# EAGLE schematic Bats n Gons (EAGLE 9.5.2)

## Sheet 1 of 2
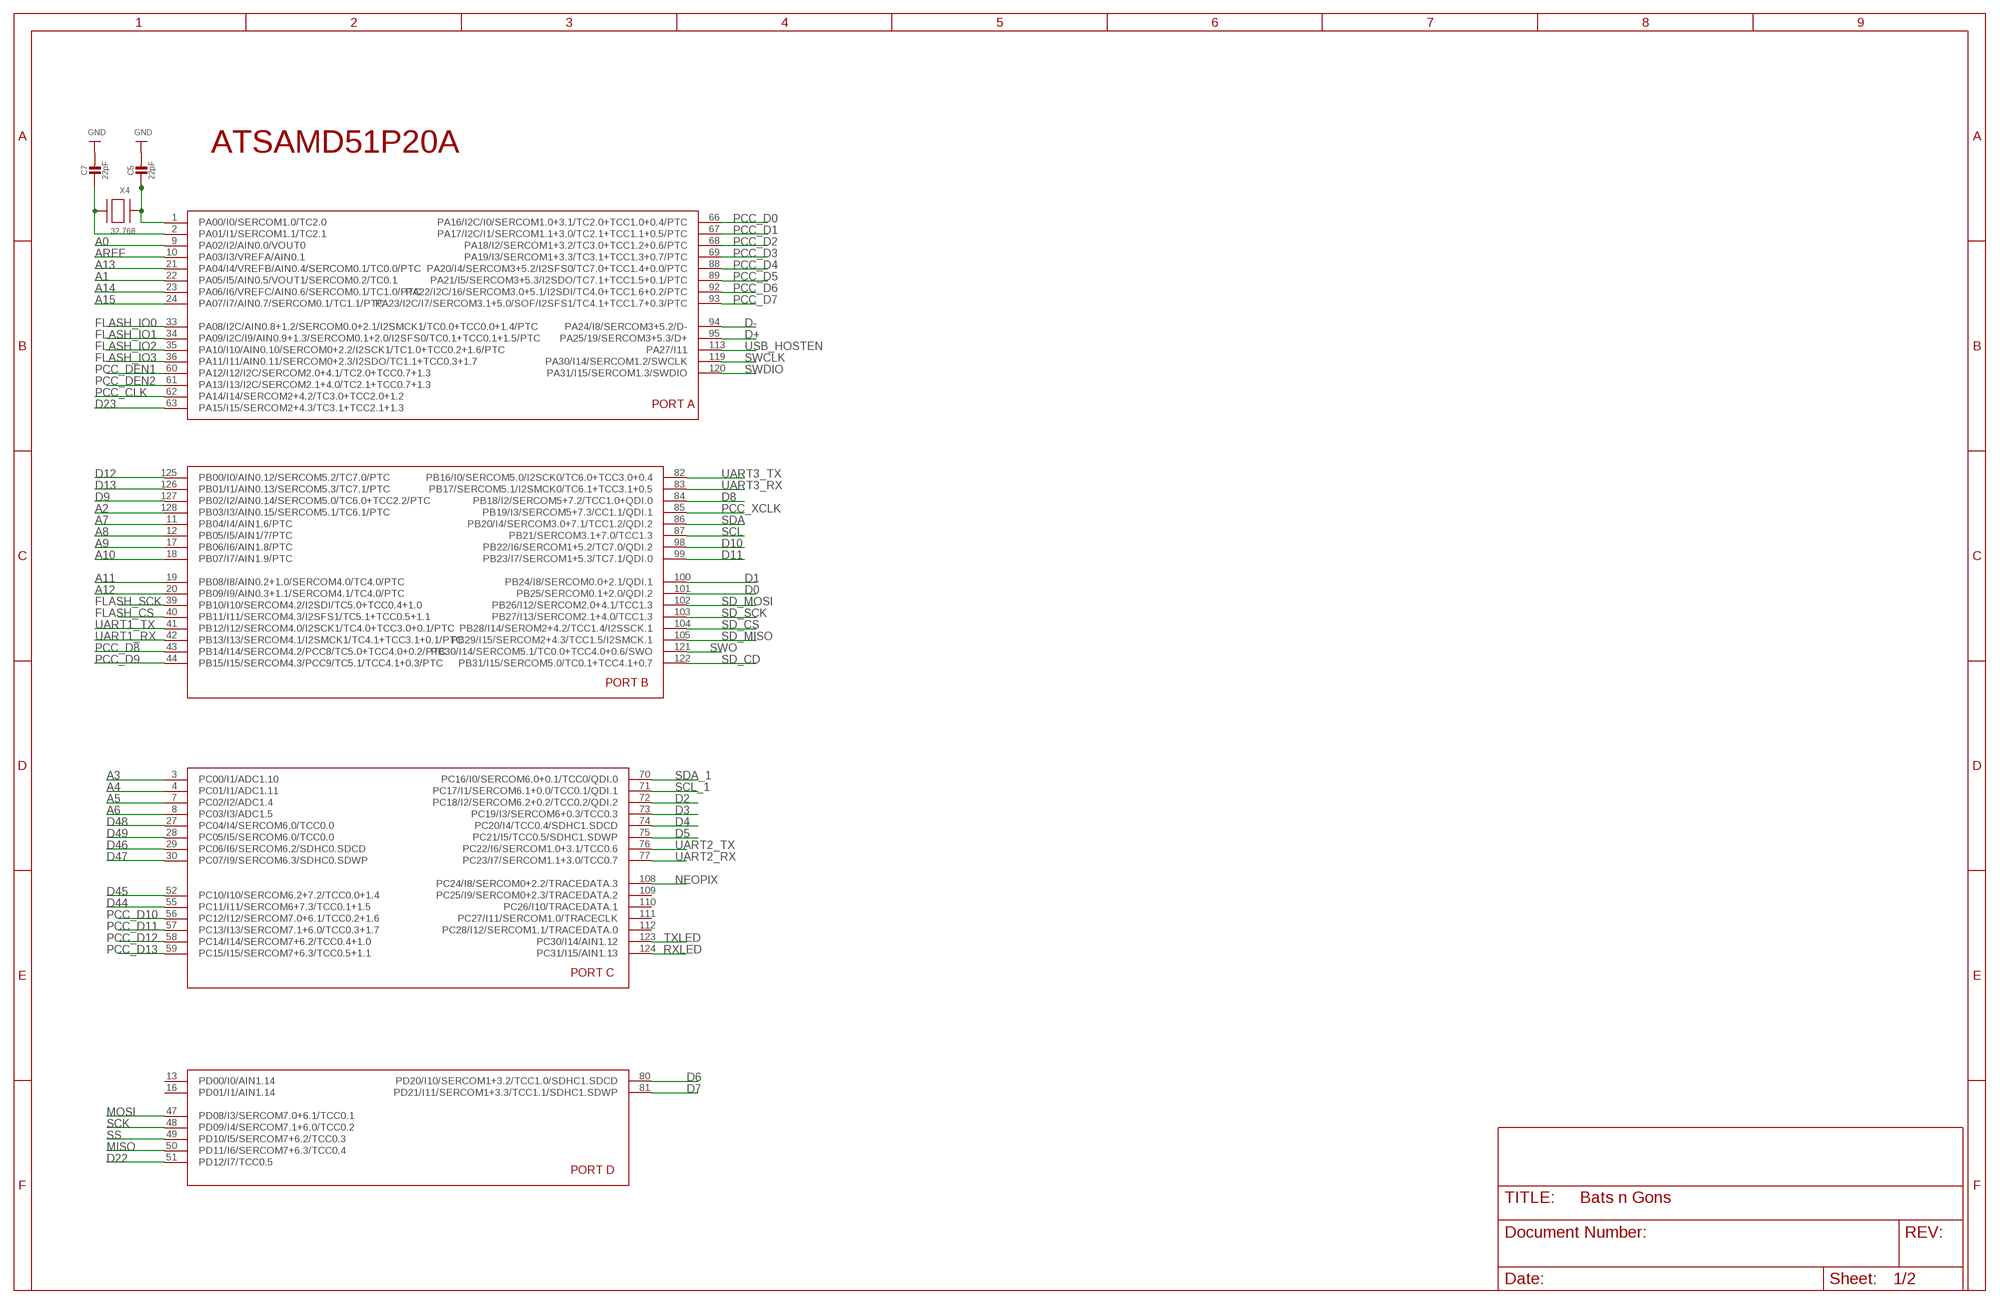
[diagram p0: schematic, sheet 1]

### Parts
C5  22pF  CAP_CERAMIC0603_NO  [0603-NO]
C7  22pF  CAP_CERAMIC0603_NO  [0603-NO]
U$1  SAMD51PXXA  [SQFP-S-14X14-128]
X4  32.768  XTAL-3.2X1.5  [XTAL3215]

### Nets
A0: U$1.9(PA02/I2/AIN0.0/VOUT0)
A1: U$1.22(PA05/I5/AIN0.5/VOUT1/SERCOM0.2/TC0.1)
A2: U$1.128(PB03/I3/AIN0.15/SERCOM5.1/TC6.1/PTC)
A3: U$1.3(PC00/I1/ADC1.10)
A4: U$1.4(PC01/I1/ADC1.11)
A5: U$1.7(PC02/I2/ADC1.4)
A6: U$1.8(PC03/I3/ADC1.5)
A7: U$1.11(PB04/I4/AIN1.6/PTC)
A8: U$1.12(PB05/I5/AIN1/7/PTC)
A9: U$1.17(PB06/I6/AIN1.8/PTC)
A10: U$1.18(PB07/I7/AIN1.9/PTC)
A11: U$1.19(PB08/I8/AIN0.2+1.0/SERCOM4.0/TC4.0/PTC)
A12: U$1.20(PB09/I9/AIN0.3+1.1/SERCOM4.1/TC4.0/PTC)
A13: U$1.21(PA04/I4/VREFB/AIN0.4/SERCOM0.1/TC0.0/PTC)
A14: U$1.23(PA06/I6/VREFC/AIN0.6/SERCOM0.1/TC1.0/PTC)
A15: U$1.24(PA07/I7/AIN0.7/SERCOM0.1/TC1.1/PTC)
AREF [aref]: U$1.10(PA03/I3/VREFA/AIN0.1)
D0: U$1.101(PB25/SERCOM0.1+2.0/QDI.2)
D1: U$1.100(PB24/I8/SERCOM0.0+2.1/QDI.1)
D2: U$1.72(PC18/I2/SERCOM6.2+0.2/TCC0.2/QDI.2)
D3: U$1.73(PC19/I3/SERCOM6+0.3/TCC0.3)
D4: U$1.74(PC20/I4/TCC0.4/SDHC1.SDCD)
D5: U$1.75(PC21/I5/TCC0.5/SDHC1.SDWP)
D6: U$1.80(PD20/I10/SERCOM1+3.2/TCC1.0/SDHC1.SDCD)
D7: U$1.81(PD21/I11/SERCOM1+3.3/TCC1.1/SDHC1.SDWP)
D8: U$1.84(PB18/I2/SERCOM5+7.2/TCC1.0+QDI.0)
D9: U$1.127(PB02/I2/AIN0.14/SERCOM5.0/TC6.0+TCC2.2/PTC)
D10: U$1.98(PB22/I6/SERCOM1+5.2/TC7.0/QDI.2)
D11: U$1.99(PB23/I7/SERCOM1+5.3/TC7.1/QDI.0)
D12: U$1.125(PB00/I0/AIN0.12/SERCOM5.2/TC7.0/PTC)
D13: U$1.126(PB01/I1/AIN0.13/SERCOM5.3/TC7.1/PTC)
D22: U$1.51(PD12/I7/TCC0.5)
D23: U$1.63(PA15/I15/SERCOM2+4.3/TC3.1+TCC2.1+1.3)
D44: U$1.55(PC11/I11/SERCOM6+7.3/TCC0.1+1.5)
D45: U$1.52(PC10/I10/SERCOM6.2+7.2/TCC0.0+1.4)
D46: U$1.29(PC06/I6/SERCOM6.2/SDHC0.SDCD)
D47: U$1.30(PC07/I9/SERCOM6.3/SDHC0.SDWP)
D48: U$1.27(PC04/I4/SERCOM6.0/TCC0.0)
D49: U$1.28(PC05/I5/SERCOM6.0/TCC0.0)
D+ [USB]: U$1.95(PA25/19/SERCOM3+5.3/D+)
D- [USB]: U$1.94(PA24/I8/SERCOM3+5.2/D-)
FLASH_CS: U$1.40(PB11/I11/SERCOM4.3/I2SFS1/TC5.1+TCC0.5+1.1)
FLASH_IO0: U$1.33(PA08/I2C/AIN0.8+1.2/SERCOM0.0+2.1/I2SMCK1/TC0.0+TCC0.0+1.4/PTC)
FLASH_IO1: U$1.34(PA09/I2C/I9/AIN0.9+1.3/SERCOM0.1+2.0/I2SFS0/TC0.1+TCC0.1+1.5/PTC)
FLASH_IO2: U$1.35(PA10/I10/AIN0.10/SERCOM0+2.2/I2SCK1/TC1.0+TCC0.2+1.6/PTC)
FLASH_IO3: U$1.36(PA11/I11/AIN0.11/SERCOM0+2.3/I2SDO/TC1.1+TCC0.3+1.7)
FLASH_SCK: U$1.39(PB10/I10/SERCOM4.2/I2SDI/TC5.0+TCC0.4+1.0)
GND [gnd]: C5.2 C7.2
MISO: U$1.50(PD11/I6/SERCOM7+6.3/TCC0.4)
MOSI: U$1.47(PD08/I3/SERCOM7.0+6.1/TCC0.1)
N$9: C5.1 U$1.1(PA00/I0/SERCOM1.0/TC2.0) X4.P$1
N$12: C7.1 U$1.2(PA01/I1/SERCOM1.1/TC2.1) X4.P$2
NEOPIX: U$1.108(PC24/I8/SERCOM0+2.2/TRACEDATA.3)
PCC_CLK: U$1.62(PA14/I14/SERCOM2+4.2/TC3.0+TCC2.0+1.2)
PCC_D0: U$1.66(PA16/I2C/I0/SERCOM1.0+3.1/TC2.0+TCC1.0+0.4/PTC)
PCC_D1: U$1.67(PA17/I2C/I1/SERCOM1.1+3.0/TC2.1+TCC1.1+0.5/PTC)
PCC_D2: U$1.68(PA18/I2/SERCOM1+3.2/TC3.0+TCC1.2+0.6/PTC)
PCC_D3: U$1.69(PA19/I3/SERCOM1+3.3/TC3.1+TCC1.3+0.7/PTC)
PCC_D4: U$1.88(PA20/I4/SERCOM3+5.2/I2SFS0/TC7.0+TCC1.4+0.0/PTC)
PCC_D5: U$1.89(PA21/I5/SERCOM3+5.3/I2SDO/TC7.1+TCC1.5+0.1/PTC)
PCC_D6: U$1.92(PA22/I2C/16/SERCOM3.0+5.1/I2SDI/TC4.0+TCC1.6+0.2/PTC)
PCC_D7: U$1.93(PA23/I2C/I7/SERCOM3.1+5.0/SOF/I2SFS1/TC4.1+TCC1.7+0.3/PTC)
PCC_D8: U$1.43(PB14/I14/SERCOM4.2/PCC8/TC5.0+TCC4.0+0.2/PTC)
PCC_D9: U$1.44(PB15/I15/SERCOM4.3/PCC9/TC5.1/TCC4.1+0.3/PTC)
PCC_D10: U$1.56(PC12/I12/SERCOM7.0+6.1/TCC0.2+1.6)
PCC_D11: U$1.57(PC13/I13/SERCOM7.1+6.0/TCC0.3+1.7)
PCC_D12: U$1.58(PC14/I14/SERCOM7+6.2/TCC0.4+1.0)
PCC_D13: U$1.59(PC15/I15/SERCOM7+6.3/TCC0.5+1.1)
PCC_DEN1: U$1.60(PA12/I12/I2C/SERCOM2.0+4.1/TC2.0+TCC0.7+1.3)
PCC_DEN2: U$1.61(PA13/I13/I2C/SERCOM2.1+4.0/TC2.1+TCC0.7+1.3)
PCC_XCLK: U$1.85(PB19/I3/SERCOM5+7.3/CC1.1/QDI.1)
RXLED: U$1.124(PC31/I15/AIN1.13)
SCK: U$1.48(PD09/I4/SERCOM7.1+6.0/TCC0.2)
SCL: U$1.87(PB21/SERCOM3.1+7.0/TCC1.3)
SCL_1: U$1.71(PC17/I1/SERCOM6.1+0.0/TCC0.1/QDI.1)
SD_CD: U$1.122(PB31/I15/SERCOM5.0/TC0.1+TCC4.1+0.7)
SD_CS: U$1.104(PB28/I14/SEROM2+4.2/TCC1.4/I2SSCK.1)
SD_MISO: U$1.105(PB29/I15/SERCOM2+4.3/TCC1.5/I2SMCK.1)
SD_MOSI: U$1.102(PB26/I12/SERCOM2.0+4.1/TCC1.3)
SD_SCK: U$1.103(PB27/I13/SERCOM2.1+4.0/TCC1.3)
SDA: U$1.86(PB20/I4/SERCOM3.0+7.1/TCC1.2/QDI.2)
SDA_1: U$1.70(PC16/I0/SERCOM6.0+0.1/TCC0/QDI.0)
SS: U$1.49(PD10/I5/SERCOM7+6.2/TCC0.3)
SWCLK: U$1.119(PA30/I14/SERCOM1.2/SWCLK)
SWDIO: U$1.120(PA31/I15/SERCOM1.3/SWDIO)
SWO: U$1.121(PB30/I14/SERCOM5.1/TC0.0+TCC4.0+0.6/SWO)
TXLED: U$1.123(PC30/I14/AIN1.12)
UART1_RX: U$1.42(PB13/I13/SERCOM4.1/I2SMCK1/TC4.1+TCC3.1+0.1/PTC)
UART1_TX: U$1.41(PB12/I12/SERCOM4.0/I2SCK1/TC4.0+TCC3.0+0.1/PTC)
UART2_RX: U$1.77(PC23/I7/SERCOM1.1+3.0/TCC0.7)
UART2_TX: U$1.76(PC22/I6/SERCOM1.0+3.1/TCC0.6)
UART3_RX: U$1.83(PB17/SERCOM5.1/I2SMCK0/TC6.1+TCC3.1+0.5)
UART3_TX: U$1.82(PB16/I0/SERCOM5.0/I2SCK0/TC6.0+TCC3.0+0.4)
USB_HOSTEN: U$1.113(PA27/I11)
Unconnected: U$1.5(GND) U$1.6(VDDANA) U$1.13(PD00/I0/AIN1.14) U$1.14(GNDANA) U$1.15(VDDANA1) U$1.16(PD01/I1/AIN1.14) U$1.25(GNDANA1) U$1.26(VDDANA2) U$1.31(GND1) U$1.32(VDDIOB) U$1.37(VDDIOB1) U$1.38(GND2) U$1.45(GND3) U$1.46(VDDIO) U$1.53(GND4) U$1.54(VDDIO1) U$1.64(GND5) U$1.65(VDDIO2) U$1.78(GND6) U$1.79(VDDIO3) U$1.90(GND7) U$1.91(VDDIO4) U$1.96(GND8) U$1.97(VDDIO5) U$1.106(GND9) U$1.107(VDDIO6) U$1.109(PC25/I9/SERCOM0+2.3/TRACEDATA.2) U$1.110(PC26/I10/TRACEDATA.1) U$1.111(PC27/I11/SERCOM1.0/TRACECLK) U$1.112(PC28/I12/SERCOM1.1/TRACEDATA.0) U$1.114(!RESET) U$1.115(VDDCORE) U$1.116(GNDIO) U$1.117(VSW) U$1.118(VDDIO7)

### Notes on the sheet
- ATSAMD51P20A

## Sheet 2 of 2
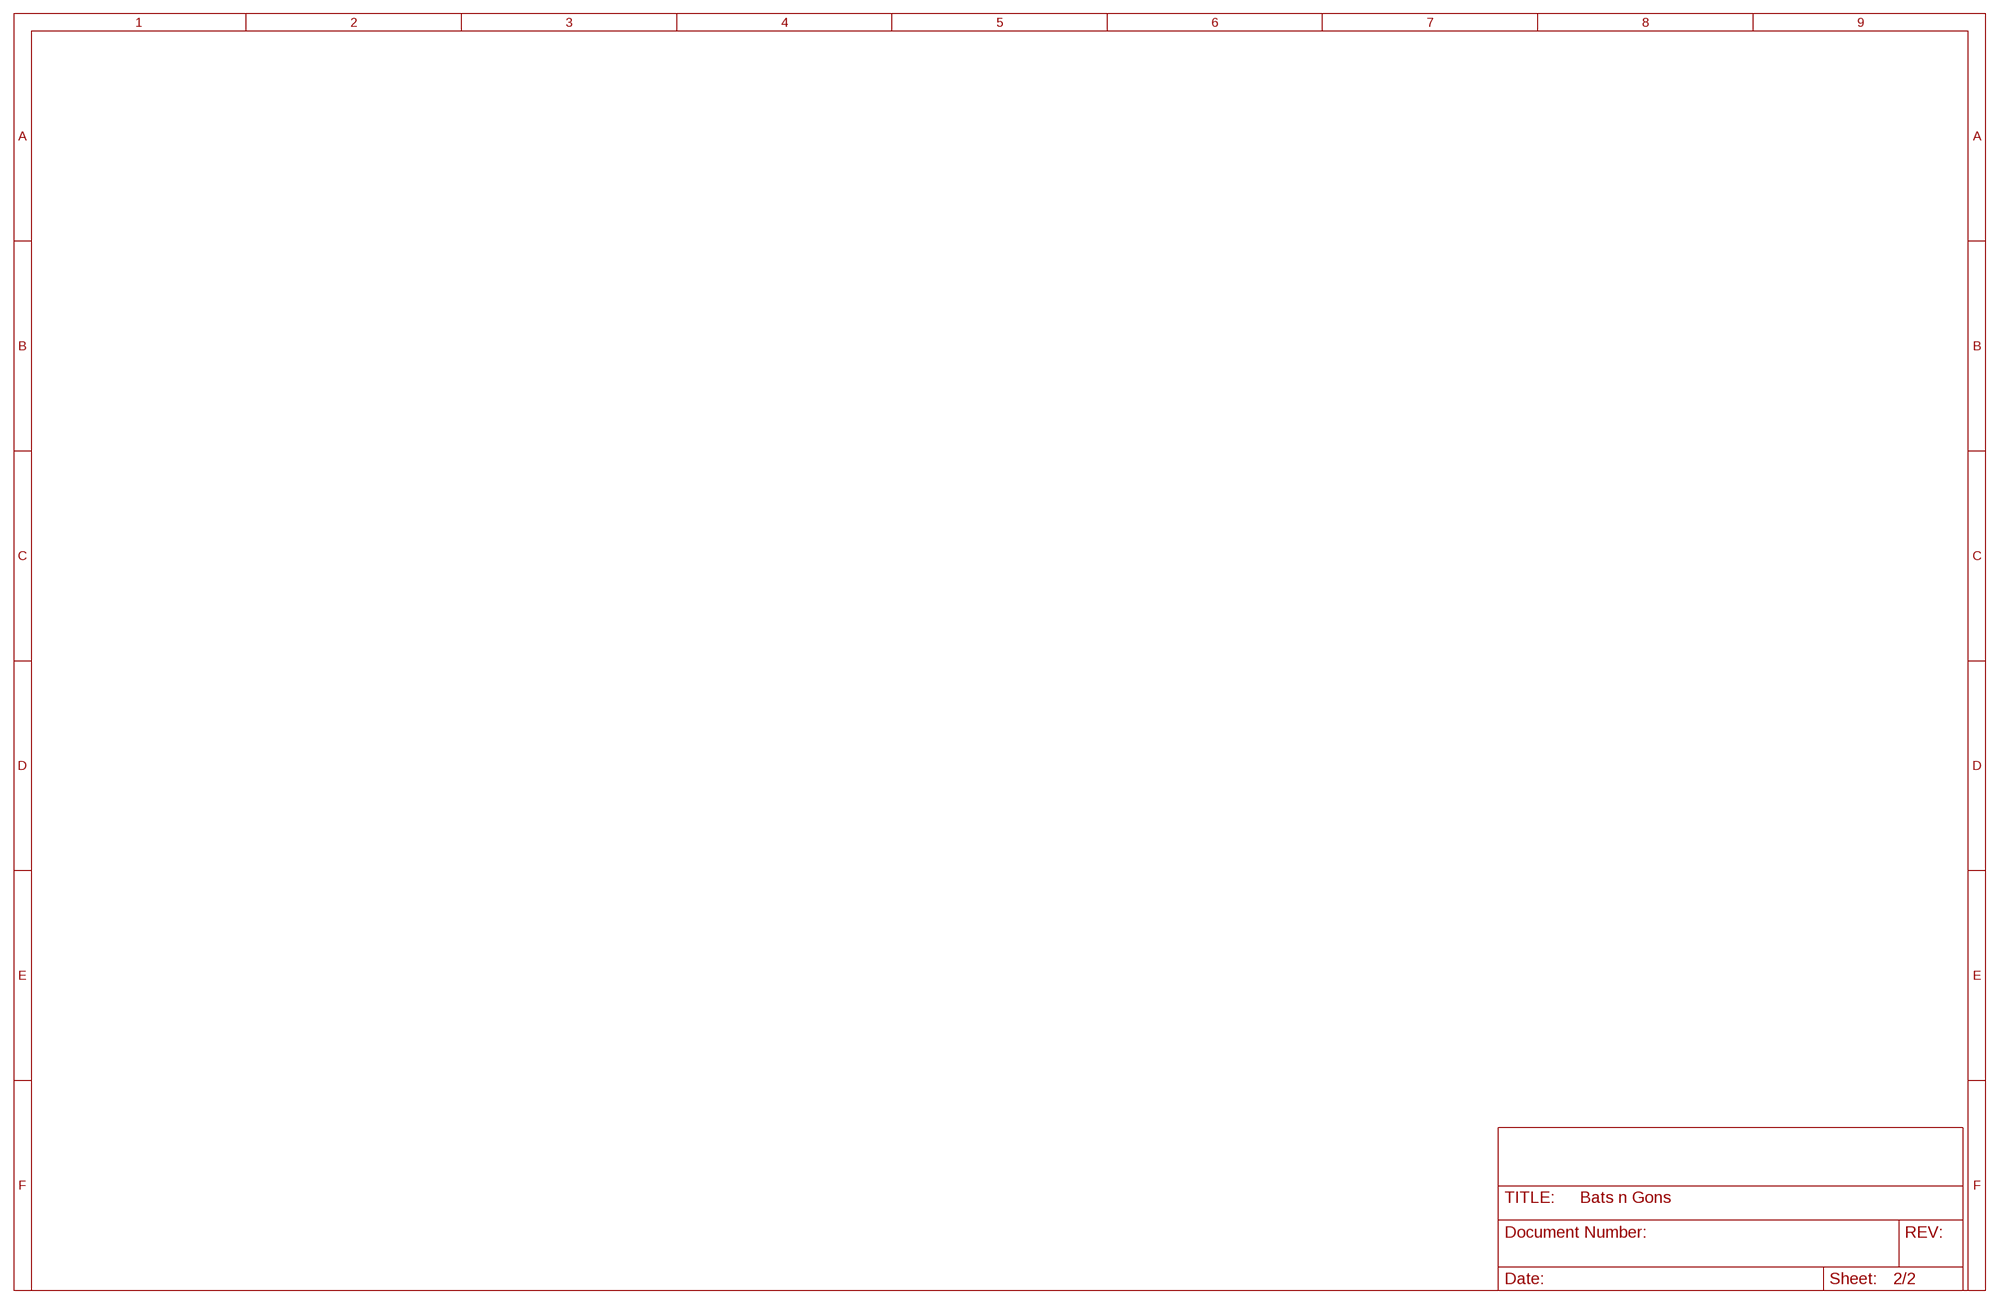
[diagram p1: schematic, sheet 2]

## Library data of the parts
C5 C7 = microbuilder:CAP_CERAMIC: Ceramic Capacitors For new designs, use the packages preceded by an '_' character since they are more reliable: The following footprints should be used on most boards: _0402 - Standard footprint for regular board layouts _0603 - Standard footprint for regular board layouts _0805 - Standard footprint for regular board layouts _1206 - Standard footprint for regular board layouts For extremely tight-pitch boards where space is at a premium, the following 'micro-pitch' footprints can be used (smaller pads, no silkscreen outline, etc.): _0402MP - Micro-pitch footprint for very dense/compact boards _0603MP - Micro-pitch footprint for very dense/compact boards _0805MP - Micro-pitch footprint for very dense/compact boards _1206MP - Micro-pitch footprint for very dense/compact boards
U$1 = microbuilder:SAMD51PXXA: SAMD51 P variant
X4 = adafruit2:XTAL: Low cost SMT crystals, no capacitors included http://www.ladyada.net/library/eagle